# Altium project Lion-IRVT.PrjPcb (part 1 of 8)
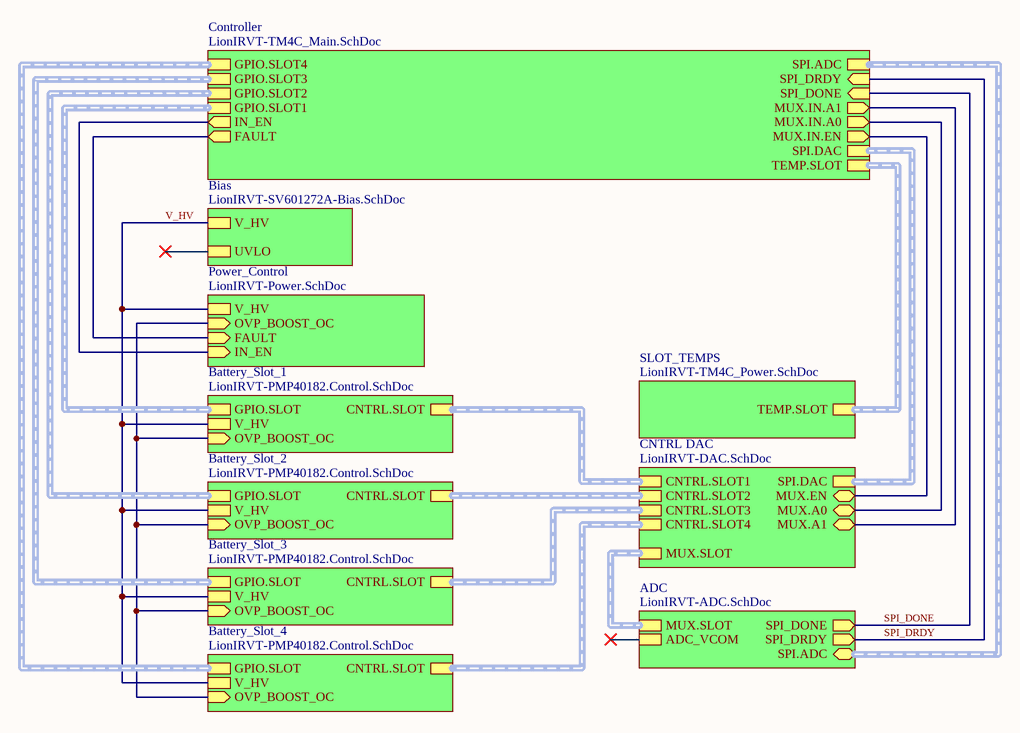
[diagram p0: LionIRVT-Base.SchDoc]
9 sheets, 943 parts. Net scope: hierarchical (ports join the sheet entries above them; power ports are global).
Board file: IRVT-001.PcbDoc
Sheets:
  LionIRVT-Base.SchDoc
    CNTRL DAC = LionIRVT-DAC.SchDoc
    Battery_Slot_1 = LionIRVT-PMP40182.Control.SchDoc
    ADC = LionIRVT-ADC.SchDoc
    Bias = LionIRVT-SV601272A-Bias.SchDoc
    Controller = LionIRVT-TM4C_Main.SchDoc
    Power_Control = LionIRVT-Power.SchDoc
    Battery_Slot_2 = LionIRVT-PMP40182.Control.SchDoc
    Battery_Slot_3 = LionIRVT-PMP40182.Control.SchDoc
    Battery_Slot_4 = LionIRVT-PMP40182.Control.SchDoc
    SLOT_TEMPS = LionIRVT-TM4C_Power.SchDoc
  LionIRVT-HW.SchDoc

## Sheet LionIRVT-Base.SchDoc
size A4

### Sub-sheets
ADC = LionIRVT-ADC.SchDoc: ADC_VCOM, SPI.ADC (bidir, harness SPI), SPI_DRDY (out), SPI_DONE (out), MUX.SLOT (harness MUX.SLOT)
Battery_Slot_1 = LionIRVT-PMP40182.Control.SchDoc: OVP_BOOST_OC (in), V_HV, CNTRL.SLOT (harness CNTRL.SLOT), GPIO.SLOT (harness GPIO.SLOT)
Battery_Slot_2 = LionIRVT-PMP40182.Control.SchDoc: OVP_BOOST_OC (in), V_HV, CNTRL.SLOT (harness CNTRL.SLOT), GPIO.SLOT (harness GPIO.SLOT)
Battery_Slot_3 = LionIRVT-PMP40182.Control.SchDoc: OVP_BOOST_OC (in), V_HV, CNTRL.SLOT (harness CNTRL.SLOT), GPIO.SLOT (harness GPIO.SLOT)
Battery_Slot_4 = LionIRVT-PMP40182.Control.SchDoc: OVP_BOOST_OC (in), V_HV, CNTRL.SLOT (harness CNTRL.SLOT), GPIO.SLOT (harness GPIO.SLOT)
Bias = LionIRVT-SV601272A-Bias.SchDoc: V_HV, UVLO
CNTRL DAC = LionIRVT-DAC.SchDoc: SPI.DAC (harness SPI), MUX.SLOT (harness MUX.SLOT), MUX.A0 (bidir), CNTRL.SLOT1 (harness CNTRL.SLOT), CNTRL.SLOT2 (harness CNTRL.SLOT), MUX.A1 (bidir), CNTRL.SLOT4 (harness CNTRL.SLOT), CNTRL.SLOT3 (harness CNTRL.SLOT), MUX.EN (bidir)
Controller = LionIRVT-TM4C_Main.SchDoc: SPI.DAC (harness SPI), SPI.ADC (harness SPI), SPI_DONE (in), SPI_DRDY (in), MUX.IN.EN (out), MUX.IN.A1 (out), MUX.IN.A0 (out), FAULT (out), IN_EN (out), GPIO.SLOT1 (harness GPIO.SLOT), GPIO.SLOT2 (harness GPIO.SLOT), GPIO.SLOT3 (harness GPIO.SLOT), GPIO.SLOT4 (harness GPIO.SLOT), TEMP.SLOT (harness TEMP.SLOT)
Power_Control = LionIRVT-Power.SchDoc: IN_EN (in), V_HV, OVP_BOOST_OC (in), FAULT (in)
SLOT_TEMPS = LionIRVT-TM4C_Power.SchDoc: TEMP.SLOT (harness TEMP.SLOT)

### Nets
V_HV: sheet Battery_Slot_1/V_HV, sheet Bias/V_HV, sheet Power_Control/V_HV, sheet Battery_Slot_2/V_HV, sheet Battery_Slot_3/V_HV, sheet Battery_Slot_4/V_HV
FAULT: sheet Controller/FAULT, sheet Power_Control/FAULT
IN_EN: sheet Controller/IN_EN, sheet Power_Control/IN_EN
MUX.IN.A0: sheet CNTRL DAC/MUX.A0, sheet Controller/MUX.IN.A0
MUX.IN.A1: sheet CNTRL DAC/MUX.A1, sheet Controller/MUX.IN.A1
MUX.IN.EN: sheet CNTRL DAC/MUX.EN, sheet Controller/MUX.IN.EN
SPI_DONE: sheet ADC/SPI_DONE, sheet Controller/SPI_DONE  [project net ADC.DONE]
SPI_DRDY: sheet ADC/SPI_DRDY, sheet Controller/SPI_DRDY  [project net ADC.DRDY]
NetD10A_1: sheet Battery_Slot_1/OVP_BOOST_OC, sheet Power_Control/OVP_BOOST_OC, sheet Battery_Slot_2/OVP_BOOST_OC, sheet Battery_Slot_3/OVP_BOOST_OC, sheet Battery_Slot_4/OVP_BOOST_OC

### Buses and harness runs
harness sheet ADC/MUX.SLOT = sheet CNTRL DAC/MUX.SLOT
harness sheet ADC/SPI.ADC = sheet Controller/SPI.ADC
harness sheet Battery_Slot_1/CNTRL.SLOT = sheet CNTRL DAC/CNTRL.SLOT1
harness sheet Battery_Slot_1/GPIO.SLOT = sheet Controller/GPIO.SLOT1
harness sheet Battery_Slot_2/CNTRL.SLOT = sheet CNTRL DAC/CNTRL.SLOT2
harness sheet Battery_Slot_2/GPIO.SLOT = sheet Controller/GPIO.SLOT2
harness sheet Battery_Slot_3/CNTRL.SLOT = sheet CNTRL DAC/CNTRL.SLOT3
harness sheet Battery_Slot_3/GPIO.SLOT = sheet Controller/GPIO.SLOT3
harness sheet Battery_Slot_4/CNTRL.SLOT = sheet CNTRL DAC/CNTRL.SLOT4
harness sheet Battery_Slot_4/GPIO.SLOT = sheet Controller/GPIO.SLOT4
harness sheet CNTRL DAC/SPI.DAC = sheet Controller/SPI.DAC
harness sheet Controller/TEMP.SLOT = sheet SLOT_TEMPS/TEMP.SLOT

### Notes on the sheet
- Title
- Size:
- Date:
- A4
- Number:
- Time:
- Revision:
- Sheet
- of
- File:

## Sheet LionIRVT-DAC.SchDoc
size 431 x 279 mm; Date: Not shown in title block; ApprovedBy: Not shown in title block; CheckedBy: Not shown in title block; Author: Not shown in title block; CompanyName: Not shown in title block; Engineer: Not shown in title block; Organization: Not shown in title block; Address1: Not shown in title block; Address2: Not shown in title block; Address3: Not shown in title block; Address4: Not shown in title block; DocumentNumber: 8; Revision: Use project parameter SCH_Rev; SheetNumber: 8; SheetTotal: 11; PageSetup: Record=PageOptions|CenterHorizontal=True|CenterVertical=True|PrintScale=1.00|XCorrection=1.00|YCorrection=1.00|PrintKind=0|BorderSize=5000000|LeftOffset=0|BottomOffset=0|Orientation=2|PaperLength=1000|PaperWidth=1000|Scale=100|PaperSource=15|PrintQuality=600|MediaType=1|DitherType=10|PaperKind=Letter|PrintScaleMode=1; CurrentTime: Not shown in title block; CurrentDate: Not shown in title block; Time: Not shown in title block; DocumentFullPathAndName: Not shown in title block; DocumentName: Not shown in title block; ModifiedDate: Not shown in title block; ImagePath: Not shown in title block
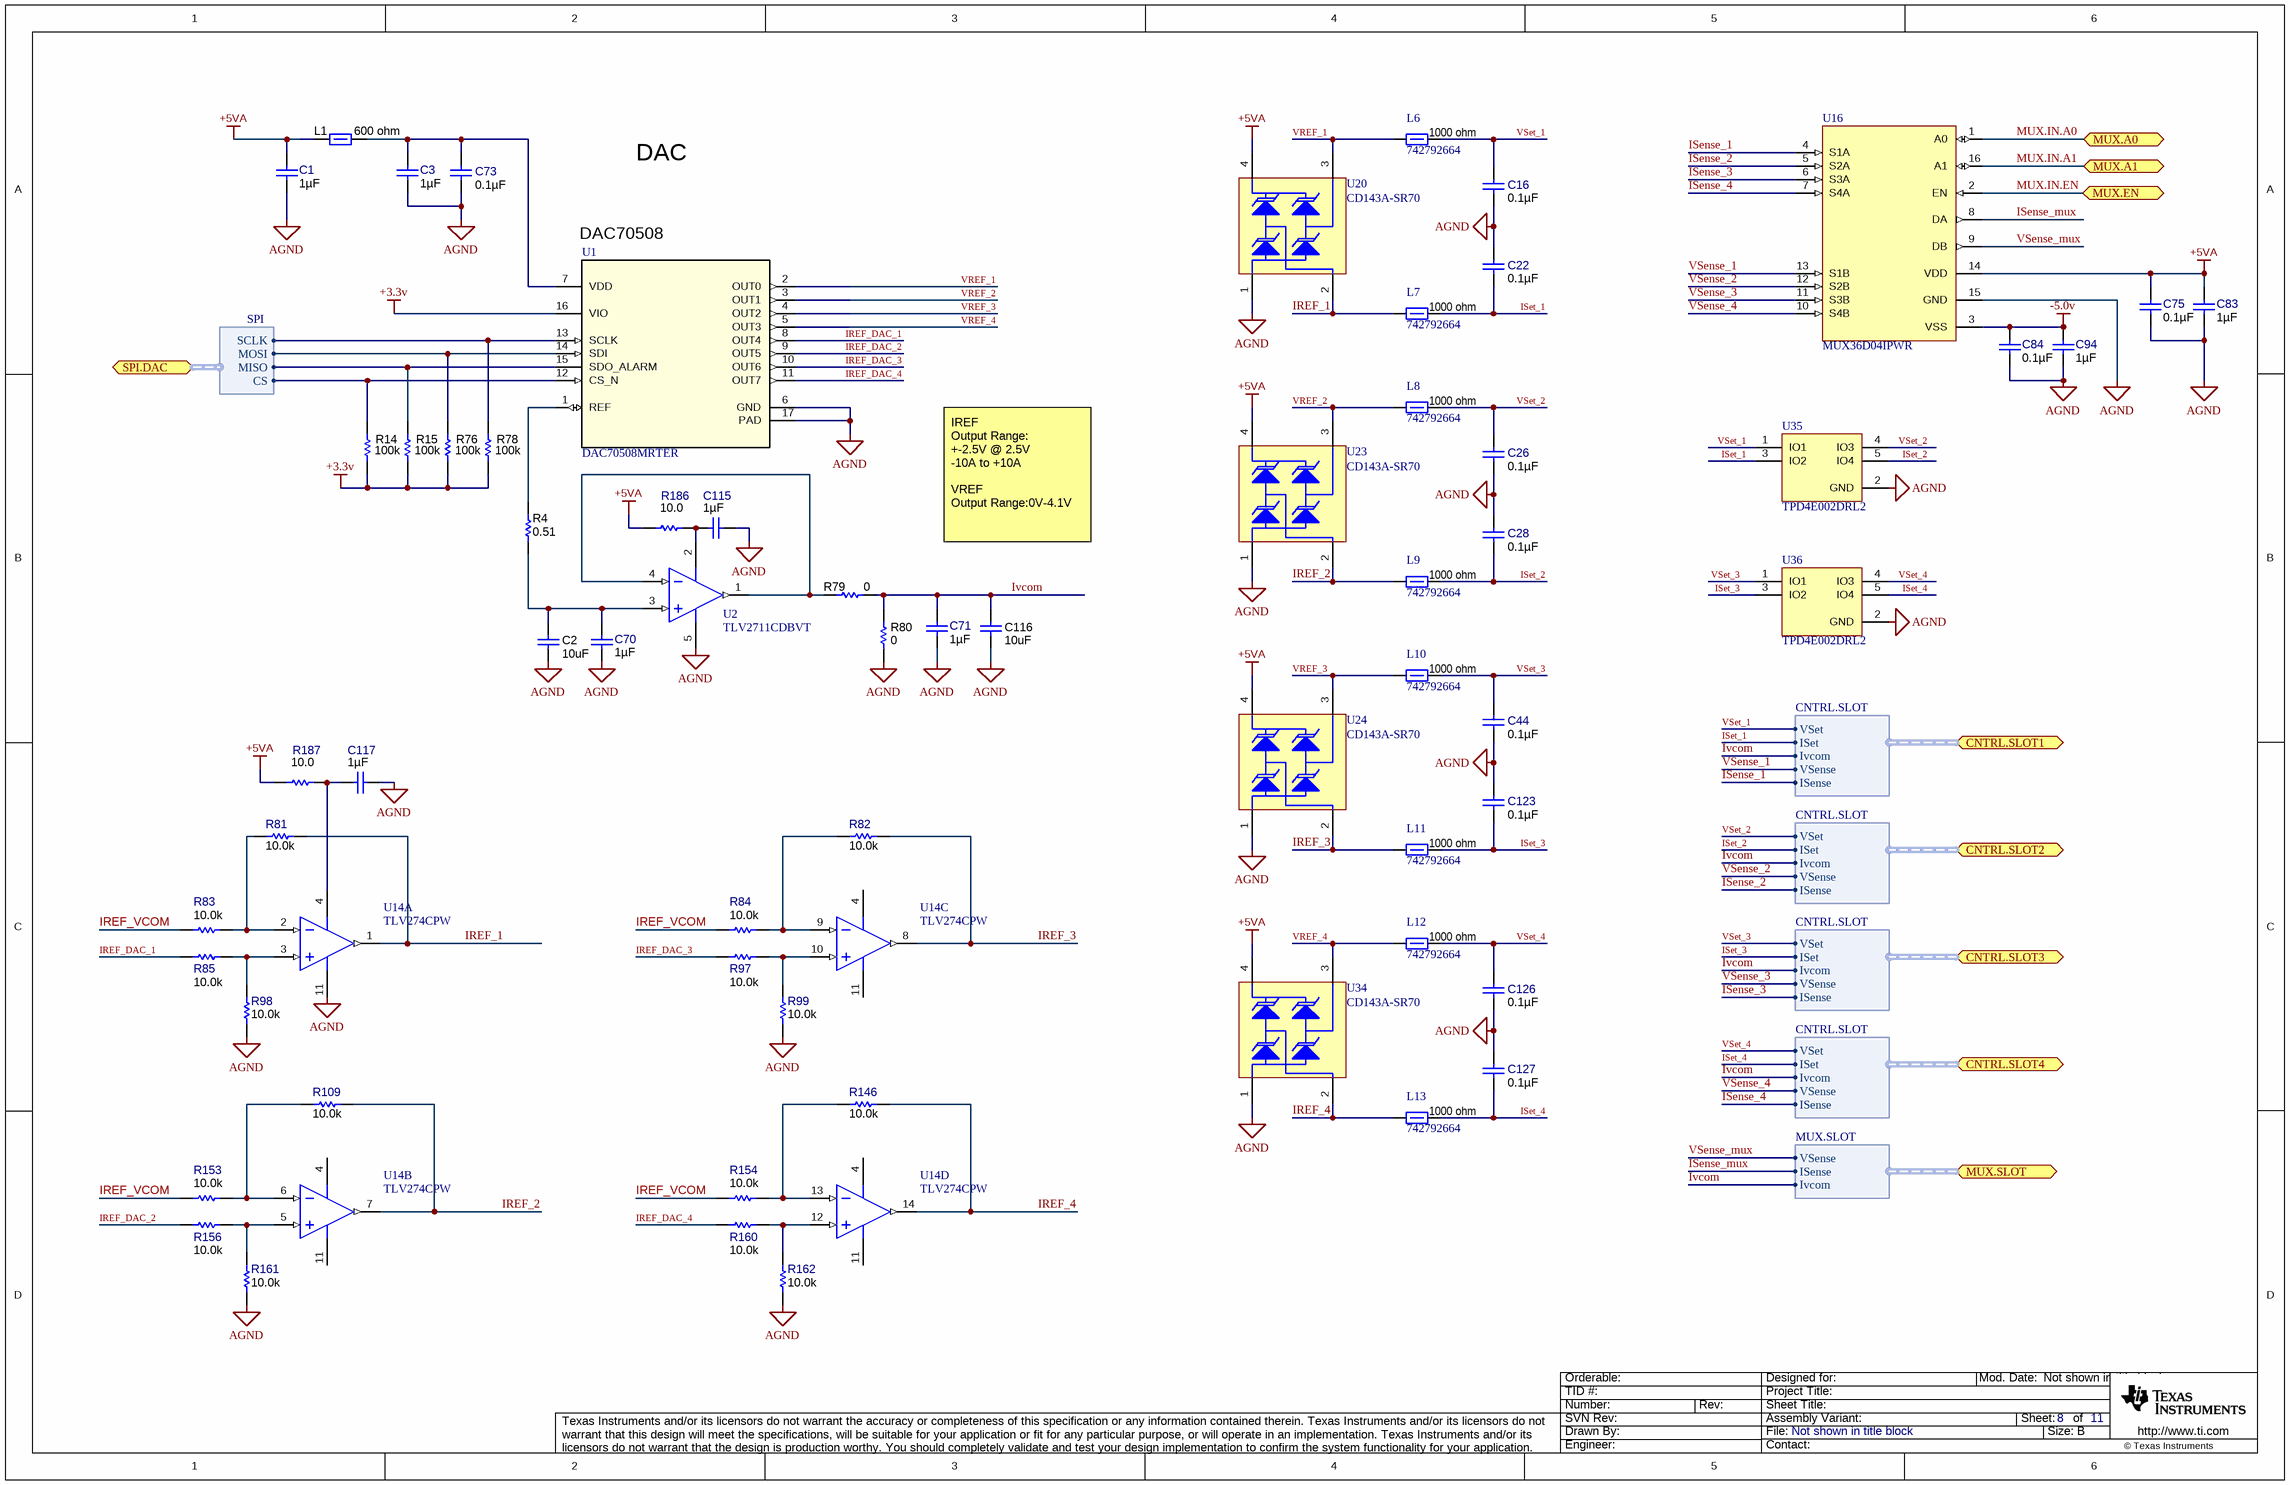
[diagram p1: LionIRVT-DAC.SchDoc]

### Parts
C1  ValueDisplayed: 1µF  [0603C]  (hidden comment: C0603C105K3RACTU)
C2  ValueDisplayed: 10uF  [0805_HV]  (hidden comment: Capacitor)
C3  ValueDisplayed: 1µF  [0603C]  (hidden comment: C0603C105K3RACTU)
C16  ValueDisplayed: 0.1µF  [0603C]  (hidden comment: C0603C104J3RACTU)
C22  ValueDisplayed: 0.1µF  [0603C]  (hidden comment: C0603C104J3RACTU)
C26  ValueDisplayed: 0.1µF  [0603C]  (hidden comment: C0603C104J3RACTU)
C28  ValueDisplayed: 0.1µF  [0603C]  (hidden comment: C0603C104J3RACTU)
C44  ValueDisplayed: 0.1µF  [0603C]  (hidden comment: C0603C104J3RACTU)
C70  ValueDisplayed: 1µF  [0603C]  (hidden comment: C0603C105K3RACTU)
C71  ValueDisplayed: 1µF  [0603C]  (hidden comment: C0603C105K3RACTU)
C73  ValueDisplayed: 0.1µF  [0603C]  (hidden comment: C0603C104J3RACTU)
C75  ValueDisplayed: 0.1µF  [0603C]  (hidden comment: C0603C104J3RACTU)
C83  ValueDisplayed: 1µF  [0603C]  (hidden comment: C0603C105K3RACTU)
C84  ValueDisplayed: 0.1µF  [0603C]  (hidden comment: C0603C104J3RACTU)
C94  ValueDisplayed: 1µF  [0603C]  (hidden comment: C0603C105K3RACTU)
C115  ValueDisplayed: 1µF  [0603C]  (hidden comment: C0603C105K3RACTU)
C116  ValueDisplayed: 10uF  [0805_HV]  (hidden comment: Capacitor)
C117  ValueDisplayed: 1µF  [0603C]  (hidden comment: C0603C105K3RACTU)
C123  ValueDisplayed: 0.1µF  [0603C]  (hidden comment: C0603C104J3RACTU)
C126  ValueDisplayed: 0.1µF  [0603C]  (hidden comment: C0603C104J3RACTU)
C127  ValueDisplayed: 0.1µF  [0603C]  (hidden comment: C0603C104J3RACTU)
L1  value 600 ohm  [0603L]  (hidden comment: Ferrite_Bead)
L6  742792664  [0603]
L7  742792664  [0603]
L8  742792664  [0603]
L9  742792664  [0603]
L10  742792664  [0603]
L11  742792664  [0603]
L12  742792664  [0603]
L13  742792664  [0603]
R4  ValueDisplayed: 0.51  [0603R]  (hidden comment: Resistor)
R14  ValueDisplayed: 100k  [0603R]  (hidden comment: Resistor)
R15  ValueDisplayed: 100k  [0603R]  (hidden comment: Resistor)
R76  ValueDisplayed: 100k  [0603R]  (hidden comment: Resistor)
R78  ValueDisplayed: 100k  [0603R]  (hidden comment: Resistor)
R79  ValueDisplayed: 0  [0603R]  (hidden comment: Resistor)
R80  ValueDisplayed: 0  [0603R]  (hidden comment: Resistor)
R81  ValueDisplayed: 10.0k  [0603R]  (hidden comment: RC0603FR-0710KL)
R82  ValueDisplayed: 10.0k  [0603R]  (hidden comment: RC0603FR-0710KL)
R83  ValueDisplayed: 10.0k  [0603R]  (hidden comment: RC0603FR-0710KL)
R84  ValueDisplayed: 10.0k  [0603R]  (hidden comment: RC0603FR-0710KL)
R85  ValueDisplayed: 10.0k  [0603R]  (hidden comment: RC0603FR-0710KL)
R97  ValueDisplayed: 10.0k  [0603R]  (hidden comment: RC0603FR-0710KL)
R98  ValueDisplayed: 10.0k  [0603R]  (hidden comment: RC0603FR-0710KL)
R99  ValueDisplayed: 10.0k  [0603R]  (hidden comment: RC0603FR-0710KL)
R109  ValueDisplayed: 10.0k  [0603R]  (hidden comment: RC0603FR-0710KL)
R146  ValueDisplayed: 10.0k  [0603R]  (hidden comment: RC0603FR-0710KL)
R153  ValueDisplayed: 10.0k  [0603R]  (hidden comment: RC0603FR-0710KL)
R154  ValueDisplayed: 10.0k  [0603R]  (hidden comment: RC0603FR-0710KL)
R156  ValueDisplayed: 10.0k  [0603R]  (hidden comment: RC0603FR-0710KL)
R160  ValueDisplayed: 10.0k  [0603R]  (hidden comment: RC0603FR-0710KL)
R161  ValueDisplayed: 10.0k  [0603R]  (hidden comment: RC0603FR-0710KL)
R162  ValueDisplayed: 10.0k  [0603R]  (hidden comment: RC0603FR-0710KL)
R186  ValueDisplayed: 10.0  [0603R]  (hidden comment: RC0603FR-0710RL)
R187  ValueDisplayed: 10.0  [0603R]  (hidden comment: RC0603FR-0710RL)
U1  DAC70508MRTER  [RTE0016D]
U2  TLV2711CDBVT  [DBV0005A_M]
U14  TLV274CPW  [PW0014A_M]  (parts A,B,C,D of 4)
U16  MUX36D04IPWR  [PW0016A_N]
U20  CD143A-SR70  [SOT143B]
U23  CD143A-SR70  [SOT143B]
U24  CD143A-SR70  [SOT143B]
U34  CD143A-SR70  [SOT143B]
U35  TPD4E002DRL2  [DRL0005A_N]
U36  TPD4E002DRL2  [DRL0005A_N]

### Ports
CNTRL.SLOT1 (bidir, harness CNTRL.SLOT), CNTRL.SLOT2 (bidir, harness CNTRL.SLOT), CNTRL.SLOT3 (bidir, harness CNTRL.SLOT), CNTRL.SLOT4 (bidir, harness CNTRL.SLOT), MUX.A0 (bidir), MUX.A1 (bidir), MUX.EN (bidir), MUX.SLOT (bidir, harness MUX.SLOT), SPI.DAC (bidir, harness SPI)

### Harnesses
SPI: CS, MISO, MOSI, SCLK
CNTRL.SLOT: VSet, ISet, Ivcom, VSense, ISense
MUX.SLOT: VSense, ISense, Ivcom

### Nets
+3.3v: R14.1 R15.1 R76.1 R78.1 U1.16(VIO)
+5VA: C1.1 C75.1 C83.2 L1.1 R186.2 R187.2 U16.14(VDD) U20.4 U23.4 U24.4 U34.4
-5.0v: C84.1 C94.2 U16.3(VSS)
AGND: C1.2 C2.2 C3.2 C16.1 C22.2 C26.1 C28.2 C44.1 C70.2 C71.2 C73.1 C75.2 C83.1 C84.2 C94.1 C115.1 C116.2 C117.1 C123.2 C126.1 C127.2 R80.1 R98.2 R99.2 R161.2 R162.2 U1.6(GND) U1.17(PAD) U2.5(VDD-/GND) U14.11(GND) U16.15(GND) U20.1 U23.1 U24.1 U34.1 U35.2(GND) U36.2(GND)
DAC.CS: R14.2 U1.12(CS_N) ; port SPI.DAC.CS
DAC.MISO: R15.2 U1.15(SDO_ALARM) ; port SPI.DAC.MISO
DAC.MOSI: R76.2 U1.14(SDI) ; port SPI.DAC.MOSI
DAC.SCLK: R78.2 U1.13(SCLK) ; port SPI.DAC.SCLK
IREF_1: L7.1 R81.2 U14.1(OUT1) U20.2
IREF_2: L9.1 R109.2 U14.7(OUT2) U23.2
IREF_3: L11.1 R82.2 U14.8(OUT3) U24.2
IREF_4: L13.1 R146.2 U14.14(OUT4) U34.2
IREF_DAC_1: R85.1 U1.8(OUT4)
IREF_DAC_2: R156.1 U1.9(OUT5)
IREF_DAC_3: R97.1 U1.10(OUT6)
IREF_DAC_4: R160.1 U1.11(OUT7)
IREF_VCOM: R83.1 R84.1 R153.1 R154.1
ISense_1: U16.4(S1A) ; port CNTRL.SLOT1.ISense  [project net ISense]
ISense_2: U16.5(S2A) ; port CNTRL.SLOT2.ISense  [project net ISense]
ISense_3: U16.6(S3A) ; port CNTRL.SLOT3.ISense  [project net ISense]
ISense_4: U16.7(S4A) ; port CNTRL.SLOT4.ISense  [project net ISense]
ISense_mux: U16.8(DA) ; port MUX.SLOT.ISense  [project net IBAT]
ISet_1: C22.1 L7.2 U35.3(IO2) ; port CNTRL.SLOT1.ISet  [project net ISet]
ISet_2: C28.1 L9.2 U35.5(IO4) ; port CNTRL.SLOT2.ISet  [project net ISet]
ISet_3: C123.1 L11.2 U36.3(IO2) ; port CNTRL.SLOT3.ISet  [project net ISet]
ISet_4: C127.1 L13.2 U36.5(IO4) ; port CNTRL.SLOT4.ISet  [project net ISet]
Ivcom: C71.1 C116.1 R79.2 R80.2 ; port CNTRL.SLOT1.Ivcom, port MUX.SLOT.Ivcom, port CNTRL.SLOT2.Ivcom, port CNTRL.SLOT3.Ivcom, port CNTRL.SLOT4.Ivcom  [project net IREF_VCOM]
MUX.IN.A0: U16.1(A0) ; port MUX.A0
MUX.IN.A1: U16.16(A1) ; port MUX.A1
MUX.IN.EN: U16.2(EN) ; port MUX.EN
VREF_1: L6.1 U1.2(OUT0) U20.3
VREF_2: L8.1 U1.3(OUT1) U23.3
VREF_3: L10.1 U1.4(OUT2) U24.3
VREF_4: L12.1 U1.5(OUT3) U34.3
VSense_1: U16.13(S1B) ; port CNTRL.SLOT1.VSense  [project net VSense]
VSense_2: U16.12(S2B) ; port CNTRL.SLOT2.VSense  [project net VSense]
VSense_3: U16.11(S3B) ; port CNTRL.SLOT3.VSense  [project net VSense]
VSense_4: U16.10(S4B) ; port CNTRL.SLOT4.VSense  [project net VSense]
VSense_mux: U16.9(DB) ; port MUX.SLOT.VSense  [project net VBAT]
VSet_1: C16.2 L6.2 U35.1(IO1) ; port CNTRL.SLOT1.VSet  [project net VSet]
VSet_2: C26.2 L8.2 U35.4(IO3) ; port CNTRL.SLOT2.VSet  [project net VSet]
VSet_3: C44.2 L10.2 U36.1(IO1) ; port CNTRL.SLOT3.VSet  [project net VSet]
VSet_4: C126.2 L12.2 U36.4(IO3) ; port CNTRL.SLOT4.VSet  [project net VSet]
NetC2_1: C2.1 C70.1 R4.1 U2.3(IN+)
NetC3_1: C3.1 C73.2 L1.2 U1.7(VDD)
NetC115_2: C115.2 R186.1 U2.2(VDD+)
NetC117_2: C117.2 R187.1 U14.4(VDD)
NetR4_2: R4.2 U1.1(REF)
NetR79_1: R79.1 U2.1(OUT) U2.4(IN-)
NetR81_1: R81.1 R83.2 U14.2(IN1-)
NetR82_1: R82.1 R84.2 U14.9(IN3-)
NetR85_2: R85.2 R98.1 U14.3(IN1+)
NetR97_2: R97.2 R99.1 U14.10(IN3+)
NetR109_1: R109.1 R153.2 U14.6(IN2-)
NetR146_1: R146.1 R154.2 U14.13(IN4-)
NetR156_2: R156.2 R161.1 U14.5(IN2+)
NetR160_2: R160.2 R162.1 U14.12(IN4+)

### Notes on the sheet
- DAC
- (near U1) DAC70508
- IREF
  Output Range:
  +-2.5V @ 2.5V
  -10A to +10A
  VREF
  Output Range:0V-4.1V
- Drawn By:
- SVN Rev:
- Number:
- TID #:
- Orderable:
- Rev:
- Sheet Title:
- File:
- Project Title:
- Designed for:
- Assembly Variant:
- Mod. Date:
- Sheet:
- Size:
- of
- B
- http://www.ti.com
- Texas Instruments and/or its licensors do not warrant the accuracy or completeness of this specification or any information contained therein. Texas Instruments and/or its licensors do not warrant that this design will meet the specifications, will be suitable for your application or fit for any particular purpose, or will operate in an implementation. Texas Instruments and/or its licensors do not warrant that the design is production worthy. You should completely validate and test your design implementation to confirm the system functionality for your application.
- Engineer:
- Contact:
- © Texas Instruments
- (in symbol PAS-IND-INDUCTOR-2) 1000 ohm

### Library data of the parts
C1 C3 C70 C71 C83 C94 C115 C117 = C0603C105K3RACTU: CAP, CERM, 1 µF, 25 V, +/- 10%, X7R, 0603; Manufacturer: Kemet; Polarized: N; CompType: Capacitor; Value: 1uF; U/M: EA; Cap_F: 0.000001; Tolerance_%: 10; Value1: Unknown; VDC_V: 25; Value2: 25V; TaMin_C: -55; TaMax_C: 125; Cap_Case: 0603; SizeArea_mm2: 1.28; SizeAreaWB_mm2: 4.68; SizeX_mm: 1.6; SizeY_mm: 0.8; SizeZ_mm: 1; AEC Category: Q200; PartNumber: C0603C105K3RACTU; PackageReference: 0603; RoHS: Y; MountType: SMT; Technology: Ceramic; TempCo: X7R; Published: 2008-06-19; Publisher: Texas Instruments; LatestRevisionDate: 2016-09-23; ComponentLink1Description: Datasheet link; ComponentLink1URL: http://capacitoredge.kemet.com/capedge2/DataSheet/Datasheet-C0603C105K3RACTU.pdf?pn=C0603C105K3RACTU; Supplier 1: Digi-Key; Supplier Part Number 1: 399-7376-1-ND; Supplier 2: Mouser; Supplier Part Number 2: 80-C0603C105K3R; Supplier 3: Farnell; Supplier Part Number 3: 2118128; AEC Qualified: ?; SymbolVersion: 2008-07-09
C2 C116 = CMP-0008273-1: CAP, CERM, 10 uF, 35 V, +/- 10%, X6S, 0805; PartNumber: GRM21BC8YA106KE11L; Manufacturer: MuRata; Polarized: N; Value: 10uF; U/M: EA; Cap_F: 10µF; Value1: Unknown; VDC_V: 35V; TaMin_C: -55°C; TaMax_C: 105°C; Cap_Case: 0805; SizeArea_mm2: 2.5; SizeAreaWB_mm2: 6.75; SizeX_mm: 2; SizeY_mm: 1.25; SizeZ_mm: 1.45; AEC Category: Q200; CompType: Capacitor; PackageReference: 0805; RoHS: Y; Tolerance_%: 10%; Value2: 35V; MountType: SMT; Technology: Ceramic; TempCo: X6S; Published: 2008-06-19; Publisher: Texas Instruments; LatestRevisionDate: 2017-03-09; ComponentLink1Description: Datasheet link; ComponentLink1URL: http://search.murata.co.jp/Ceramy/image/img/A01X/G101/ENG/GRM21BC8YA106KE11-01.pdf; Supplier 1: Digi-Key; Supplier Part Number 1: 490-10504-1-ND; Supplier 2: Newark; Supplier Part Number 2: 96Y9269; Supplier 3: Mouser; Supplier Part Number 3: 81-GRM21BC8YA106KE1L; AEC Qualified: N; AEC Grade: N/A
C16 C22 C26 C28 C44 C73 C75 C84 C123 C126 C127 = C0603C104J3RACTU: CAP, CERM, 0.1 µF, 25 V, +/- 5%, X7R, 0603; Manufacturer: Kemet; Polarized: N; CompType: Capacitor; Value: 0.1uF; U/M: EA; Cap_F: 0.0000001; Tolerance_%: 5; Value1: Unknown; VDC_V: 25; Value2: 25V; TaMin_C: -55; TaMax_C: 125; Cap_Case: 0603; SizeArea_mm2: 1.28; SizeAreaWB_mm2: 4.68; SizeX_mm: 1.6; SizeY_mm: 0.8; SizeZ_mm: 1; AEC Category: Q200; SymbolVersion: 2008-07-09; PartNumber: C0603C104J3RACTU; PackageReference: 0603; RoHS: Y; MountType: SMT; Technology: Ceramic; TempCo: X7R; Published: 2008-06-19; Publisher: Texas Instruments; LatestRevisionDate: 2016-09-23; ComponentLink1Description: Datasheet link; ComponentLink1URL: http://www.kemet.com/kemet/web/homepage/kechome.nsf/vapubfiles/F3102_Y5V.pdf/$file/F3102_Y5V.pdf; Supplier 1: Digi-Key; Supplier Part Number 1: 399-1282-1-ND; Supplier 2: Mouser; Supplier Part Number 2: 80-C0603C104J3R; Supplier 3: Farnell; Supplier Part Number 3: 1650833; AEC Qualified: ?
L1 = Ferrite_Bead: Ferrite Bead, 600 ohm @ 100 MHz, 1 A, 0603; PartNumber: 742792651; Manufacturer: Wurth Elektronik; Imax_A: 1A; DCR_ohm: 2d; Value1: 0.2 ohm; ZTyp@100MHz_Ohm: 600; Ztyp@1GHz_Ohm: 257.548; SizeArea_mm2: 1.28; SizeAreaWB_mm2: 4.68; SizeX_mm: 1.6; SizeY_mm: 0.8; SizeZ_mm: 1; CompType: Ferrite Bead; Value2: 1A; MountType: SMT; PackageReference: 0603; Published: 2014-04-30; Publisher: Texas Instruments; LatestRevisionDate: 2017-03-09; ComponentLink1Description: Datasheet link; ComponentLink1URL: http://katalog.we-online.de/pbs/datasheet/742792651.pdf; RoHS: Y; Supplier 1: Digi-Key; Supplier Part Number 1: 732-1593-1-ND; Supplier 2: Newark; Supplier Part Number 2: 08P2439; Supplier 3: Mouser; Supplier Part Number 3: 710-742792651; ValueDisplayed: 600 ohm
L6-L13 = PAS-IND-INDUCTOR-2: SMD EMI Suppression Ferrite Bead WE-CBF, Z = 1000 Ohm; PackageReference: SMD-0603; Impedance: 1000 Ohm; ComponentLink2URL: http://www.we-online.de/katalog/media/pdf/742792664.pdf; PackageVersion: 2009; PackageDescription: Chip Inductor, 2-Leads, Body 1.6 x 0.8 mm; DatasheetVersion: ver 2, Jul-2006; ComponentLink1Description: Manufacturer Link; ComponentLink1URL: http://www.we-online.com; ComponentLink2Description: Datasheet
R4 = CMP-0022717-2: RES, 0.51, 1%, 0.1 W, AEC-Q200 Grade 1, 0603; PartNumber: ERJ-3RQFR51V; Manufacturer: Panasonic; Value: 0.51; Res_ohm: 5.1d; Value_Code: R510; Power_W: 100mW; Value2: 0.1W; TempCo: 300 ppm/C; SizeArea_mm2: 1.28; SizeX_mm: 1.6; SizeY_mm: 0.8; SizeZ_mm: 1; EIA_Code: E96; U/M: EA; AEC Category: Q200; AEC Qualified: Y; CompType: Resistor; PackageReference: 0603; RoHS: Y; Tolerance_%: 1%; Value1: 1%; MountType: SMT; Technology: Thick Film; Published: 2008-06-26; Publisher: Texas Instruments; LatestRevisionDate: 2017-03-09; ComponentLink1Description: Datasheet link; ComponentLink1URL: http://industrial.panasonic.com/www-data/pdf/AOA0000/AOA0000CE3.pdf; Supplier 1: Digi-Key; Supplier Part Number 1: P.51AJCT-ND; Supplier 2: Newark; Supplier Part Number 2: 51W9702; Supplier 3: Mouser; Supplier Part Number 3: 667-ERJ-3RQFR51V; AEC Grade: 1
R14 R15 R76 R78 = CMP-0021990-4: RES, 100 k, 1%, 0.1 W, AEC-Q200 Grade 0, 0603; PartNumber: CRCW0603100KFKEA; Manufacturer: Vishay-Dale; Value: 100k; Power_W: 100mW; Value2: 0.1W; VDC_V: 75V; TempCo: 100 ppm/C; EIA_Code: E96; AEC Category: Q200; AEC Qualified: Y; AEC Grade: 0; SizeArea_mm2: 1.28; SizeX_mm: 1.6; SizeY_mm: 0.8; SizeZ_mm: 1; CompType: Resistor; PackageReference: 0603; RoHS: E; Res_ohm: 100k; Value_Code: 100k; Tolerance_%: 1%; Value1: 1%; MountType: SMT; Technology: Thick Film; ComponentLink1Description: Datasheet link; ComponentLink1URL: http://www.vishay.com/docs/20035/dcrcwe3.pdf; Supplier 1: Digi-Key; Supplier Part Number 1: 541-100KHCT-ND; Supplier 2: Newark; Supplier Part Number 2: 42K3668; Supplier 3: Mouser; Supplier Part Number 3: 71-CRCW0603-100K-E3
R79 R80 = CMP-0025874-3: RES, 0, 5%, 0.1 W, 0603; PartNumber: ERJ-3GEY0R00V; Manufacturer: Panasonic; Value: 0; Value_Code: 0000; Power_W: 100mW; Value2: 0.1W; VDC_V: 50V; TempCo: 600 ppm/C; EIA_Code: E24; U/M: EA; AEC Category: Q200; SizeArea_mm2: 1.28; SizeX_mm: 1.6; SizeY_mm: 0.8; SizeZ_mm: 1; CompType: Resistor; PackageReference: 0603; RoHS: Y; Res_ohm: 0; Tolerance_%: 5%; Value1: 5%; MountType: SMT; Technology: Thick Film; Published: 2008-06-26; Publisher: Texas Instruments; LatestRevisionDate: 2017-03-09; ComponentLink1Description: Datasheet link; ComponentLink1URL: http://www.panasonic.com/industrial/components/pdf/AOA0000CE1.pdf; Supplier 1: Digi-Key; Supplier Part Number 1: P0.0GCT-ND; Supplier 2: Mouser; Supplier Part Number 2: 667-ERJ-3GEY0R00V; Supplier 3: Farnell; Supplier Part Number 3: 2059527; AEC Qualified: ?
R81-R85 R97-R99 R109 R146 R153 R154 R156 R160-R162 = RC0603FR-0710KL: RES, 10.0 k, 1%, 0.1 W, 0603; Manufacturer: Yageo America; CompType: Resistor; Value: 10.0k; Res_ohm: 10000; Value_Code: 10k0; Tolerance_%: 1; Power_W: 0.1; Value2: 0.1W; VDC_V: 150; TempCo: 200 ppm/C; SizeArea_mm2: 1.28; SizeX_mm: 1.6; SizeY_mm: 0.8; EIA_Code: E96; U/M: EA; AEC Category: Q200; SymbolVersion: 2009-05-29; PartNumber: RC0603FR-0710KL; PackageReference: 0603; RoHS: Y; Value1: 1%; MountType: SMT; Technology: Thick Film; SizeZ_mm: 1; Published: 2008-06-26; Publisher: Texas Instruments; LatestRevisionDate: 2017-03-04; ComponentLink1Description: Datasheet link; ComponentLink1URL: http://www.yageo.com/pdf/Pu-RC0603_51_PbFree_L_2.pdf; Supplier 1: Digi-Key; Supplier Part Number 1: 311-10.0KHRCT-ND; Supplier 2: Mouser; Supplier Part Number 2: 603-RC0603FR-0710KL; Supplier 3: Farnell; Supplier Part Number 3: 9238603; AEC Qualified: ?
R186 R187 = RC0603FR-0710RL: RES, 10.0, 1%, 0.1 W, 0603; Manufacturer: Yageo America; CompType: Resistor; Value: 10.0; Res_ohm: 10; Value_Code: 10R0; Tolerance_%: 1; Power_W: 0.1; Value2: 0.1W; VDC_V: 150; TempCo: 200 ppm/C; SizeArea_mm2: 1.28; SizeX_mm: 1.6; SizeY_mm: 0.8; EIA_Code: E96; U/M: EA; AEC Category: Q200; SymbolVersion: 2009-05-29; PartNumber: RC0603FR-0710RL; PackageReference: 0603; RoHS: Y; Value1: 1%; MountType: SMT; Technology: Thick Film; SizeZ_mm: 1; Published: 2008-06-26; Publisher: Texas Instruments; LatestRevisionDate: 2016-09-18; ComponentLink1Description: Datasheet link; ComponentLink1URL: http://www.yageo.com/pdf/Pu-RC0603_51_PbFree_L_2.pdf; Supplier 1: Digi-Key; Supplier Part Number 1: 311-10.0HRCT-ND; Supplier 2: Mouser; Supplier Part Number 2: 603-RC0603FR-0710RL; Supplier 3: Farnell; Supplier Part Number 3: 9238247; AEC Qualified: ?
U1 = DAC70508MRTER: No Description Available; PartNumber: DAC70508ZRTER; Manufacturer: Texas Instruments; RefDes: RefDes; Type: DEV; Value: Value; Copyright: Copyright (C) 2018 Accelerated Designs. All rights reserved
U2 = CMP-0271-00232-3: Single LinCMOS(TM) Rail-to-Rail uPower Operational Amplifier, 2.7 to 10 V, 0 to 70 degC, 5-pin SOT23 (DBV5), Green (RoHS & no Sb/Br); Manufacturer: Texas Instruments; Sub Family: Low Power Amp (<=500uA), Low Supply Voltage Amplifier (<=2.7V), Precision Amplifier; Total Supply Voltage(Min)(+5V is 5, +/-5V is 10): 2.7; Total Supply Voltage(Max)(+5V is 5, +/-5V is 10): 10; Slew Rate(Typ)(V/us): 0.025; Vio (25C)(Max)(mV): 3; IIB(Max)(pA): 60; Offset Drift(Typ)(uV/C): 1; CMRR(Min)(dB): 65; Vn at 1kHz(Typ)(nV/rtHz): 22; PackageVersion: 4073253-4/K, 03/2006; PackageDescription: 5-Pin Plastic Small Outline, Body 1.6 x 2.9 mm, Pitch 0.95 mm; DatasheetVersion: SLOS196A; ComponentLink3URL: http://www.ti.com/litv/pdf/mpds018i; Eco-Plan: Green (RoHS & no Sb/Br); ComponentLink2Description: Datasheet; ComponentLink2URL: http://www.ti.com/general/docs/lit/getliterature.tsp?genericPartNumber=TLV2711&fileType=pdf; PartNumber: TLV2711CDBVT; PackageReference: DBV0005A; Code_JEDEC: MO-178; Mounting Technology: Surface Mount; Iq per channel(Max)(mA): 0.025; ComponentLink1Description: Manufacturer URL; ComponentLink3Description: Package Specification; Number of Channels: 1; ComponentLink1URL: http://www.ti.com/
U14 = CMP-0272-04009-3: 550 uA/Ch, 3 MHz, Rail-to-Rail Output Operational Amplifier, 2.7 to 16 V, 0 to 70 degC, 14-pin SOP (PW14), Green (RoHS & no Sb/Br); Manufacturer: Texas Instruments; IIB(Max)(pA): 60; Total Supply Voltage(Min)(+5V is 5, +/-5V is 10): 2.7; Packing: TUBE; Offset Drift(Typ)(uV/C): 2; Slew Rate(Typ)(V/us): 2.4; Rating: Catalog; Iq per channel(Max)(mA): 0.55; Vio (25C)(Max)(mV): 5; GBW(Typ)(MHz): 3; CMRR(Min)(dB): 69; Sub Family: Low Supply Voltage Amplifier (<=2.7V), Precision Amplifier; Total Supply Voltage(Max)(+5V is 5, +/-5V is 10): 16; Number of Channels: 4; ComponentLink3URL: http://www.ti.com/litv/pdf/mpds360; PackageReference: PW0014A; Eco-Plan: Green (RoHS & no Sb/Br); DatasheetVersion: SLOS351D; PartNumber: TLV274CPW; Mounting Technology: Surface Mount; Code_JEDEC: MO-153; ComponentLink2Description: Datasheet; ComponentLink1Description: Manufacturer URL; PackageDescription: 14-Pin Plastic Small Outline, Body 5 x 4.4 mm, Pitch 0.65 mm; ComponentLink1URL: http://www.ti.com/; ComponentLink3Description: Package Specification; ComponentLink2URL: http://www.ti.com/lit/ds/symlink/tlv274.pdf; PackageVersion: 4040064-3/G, 02/2011
U16 = MUX36D04IPWR: No Description Available; Manufacturer: Texas Instruments; PartNumber: MUX36D04IPWR; RefDes: RefDes; Type: DEV; Value: Value; Copyright: Copyright (C) 2018 Accelerated Designs. All rights reserved
U20 U23 U24 U34 = CD143A-SR70: TVS DIODE 7V SOT143; Manufacturer: Bourns; Direction: Unidirectional; Working Voltage: 70V; Element Configuration: Dual; Max Surge Current: 24A; Number of Bidirectional Channels: 2; Power Line Protection: No; Breakdown Voltage: 85V; Leakage Current: 1uA; Test Current: 50uA; ESD Protection: Yes; Max Reverse Current: 100nA; Reverse Recovery Time: 4ns; Supplier 1: Digi-Key; Manufacturer Part Number: CD143A-SR70; RoHS: Yes; Category: TVS Diodes; Stock 1: 14865; Pricing 1: 1=0.91000, 10=0.81100, 100=0.57750, 500=0.48950, 1000=0.39875 (USD); Mount: Surface Mount; Case/Package: SOT-143; Number of Pins: 4; Contact Plating: Tin; Min Operating Temperature: -55°C; Max Operating Temperature: 150°C; Package Quantity: 1; Packaging: Tape and Reel; Clamping Voltage: 7V; Termination: SMD/SMT; Polarity: Unidirectional; Number of Channels: 2; Peak Pulse Current: 24A; Reverse Standoff Voltage: 70V; Min Breakdown Voltage: 85V; Max Reverse Leakage Current: 1uA; Max Breakdown Voltage: 85V; Reverse Breakdown Voltage: 85V; Number of Elements: 2; Length: 3.04mm; Width: 1.39mm; Height: 1.14mm; Depth: 1.39mm; Radiation Hardening: No; REACH SVHC: No SVHC; ComponentLink1URL: https://datasheet.ciiva.com/336/cd143a-sr70-336789.pdf?src-supplier=Digi-Key; ComponentLink1Description: https://datasheet.ciiva.com/336/cd143a-sr70-336789.pdf?src-supplier=Digi-Key; ComponentLink2URL: https://datasheet.ciiva.com/30478/0900766b8118997a-30478775.pdf?src-supplier=RSComponents; ComponentLink2Description: https://datasheet.ciiva.com/30478/0900766b8118997a-30478775.pdf?src-supplier=RSComponents; ComponentLink3URL: https://datasheet.ciiva.com/4509/cd143a-sr70-6316-4509754.pdf?src-supplier=Mouser; ComponentLink3Description: https://datasheet.ciiva.com/4509/cd143a-sr70-6316-4509754.pdf?src-supplier=Mouser; ComponentLink4URL: https://datasheet.ciiva.com/15143/getdatasheetpartid-137227-15143664.pdf?src-supplier=Verical; ComponentLink4Description: https://datasheet.ciiva.com/15143/getdatasheetpartid-137227-15143664.pdf?src-supplier=Verical; ComponentLink5URL: https://datasheet.ciiva.com/1276/1-1276625.pdf?src-supplier=Element14; ComponentLink5Description: https://datasheet.ciiva.com/1276/1-1276625.pdf?src-supplier=Element14; ComponentLink6URL: https://datasheet.ciiva.com/3021/cd143a-sr70-3021745.pdf?src-supplier=Avnet; ComponentLink6Description: https://datasheet.ciiva.com/3021/cd143a-sr70-3021745.pdf?src-supplier=Avnet; ComponentLink7URL: https://datasheet.ciiva.com/26787/cd143a-sr70-26787421.pdf?src-supplier=IIIC; ComponentLink7Description: https://datasheet.ciiva.com/26787/cd143a-sr70-26787421.pdf?src-supplier=IIIC; ComponentLink8URL: https://datasheet.ciiva.com/25955/cd143a-sr70-25955653.pdf?src-supplier=Avnet+Europe; ComponentLink8Description: https://datasheet.ciiva.com/25955/cd143a-sr70-25955653.pdf?src-supplier=Avnet+Europe; ComponentLink9URL: https://datasheet.ciiva.com/336/cd143a-sr70-336790.pdf?src-supplier=Digi-Key; ComponentLink9Description: https://datasheet.ciiva.com/336/cd143a-sr70-336790.pdf?src-supplier=Digi-Key; ComponentLink10URL: https://datasheet.ciiva.com/336/cd143a-sr70-336791.pdf?src-supplier=Digi-Key; ComponentLink10Description: https://datasheet.ciiva.com/336/cd143a-sr70-336791.pdf?src-supplier=Digi-Key; ComponentLink11URL: https://datasheet.ciiva.com/1281/1-1281183.pdf?src-supplier=Farnell; ComponentLink11Description: https://datasheet.ciiva.com/1281/1-1281183.pdf?src-supplier=Farnell; Supplier Part Number 1: CD143A-SR70CT-ND
U35 U36 = CMP-0326-00051-3: Low-Capacitance Array with + / - 15 kV ESD Protection, 4 Channels, -40 to +85 degC, 5-pin SOT (DRL), Green (RoHS & no Sb/Br); Manufacturer: Texas Instruments; Breakdown Voltage(Min)(V): 6; IEC 61000-4-2 Air-Gap(+/- kV): 15; IO Leakage Current(nA): 100; IO Capacitance(Typ)(pF): 11; SubFamily: ESD Solution; ComponentLink2Description: Datasheet; ComponentLink1URL: http://www.ti.com/; PackageDescription: 5-Pin Plastic Small Outline, Flat Lead 0.5 mm Pitch; ComponentLink3URL: SamplesURL:http://www.ti.com/product/tpd4e002#samples; PackageVersion: revD, Aug-2007; Mounting Technology: Surface Mount; PartNumber: TPD4E002DRL2; ComponentLink2URL: http://www.ti.com/general/docs/lit/getliterature.tsp?genericPartNumber=TPD4E002&fileType=pdf; IEC 61000-4-2 Contact(+/- kV): 15; DatasheetVersion: SLVS615D; Eco-Plan: Green (RoHS & no Sb/Br); ComponentLink1Description: Manufacturer URL; ComponentLink3Description: URL Link1; PackageReference: DRL0005A